# EAGLE schematic Hank2 (EAGLE 7.7.0)
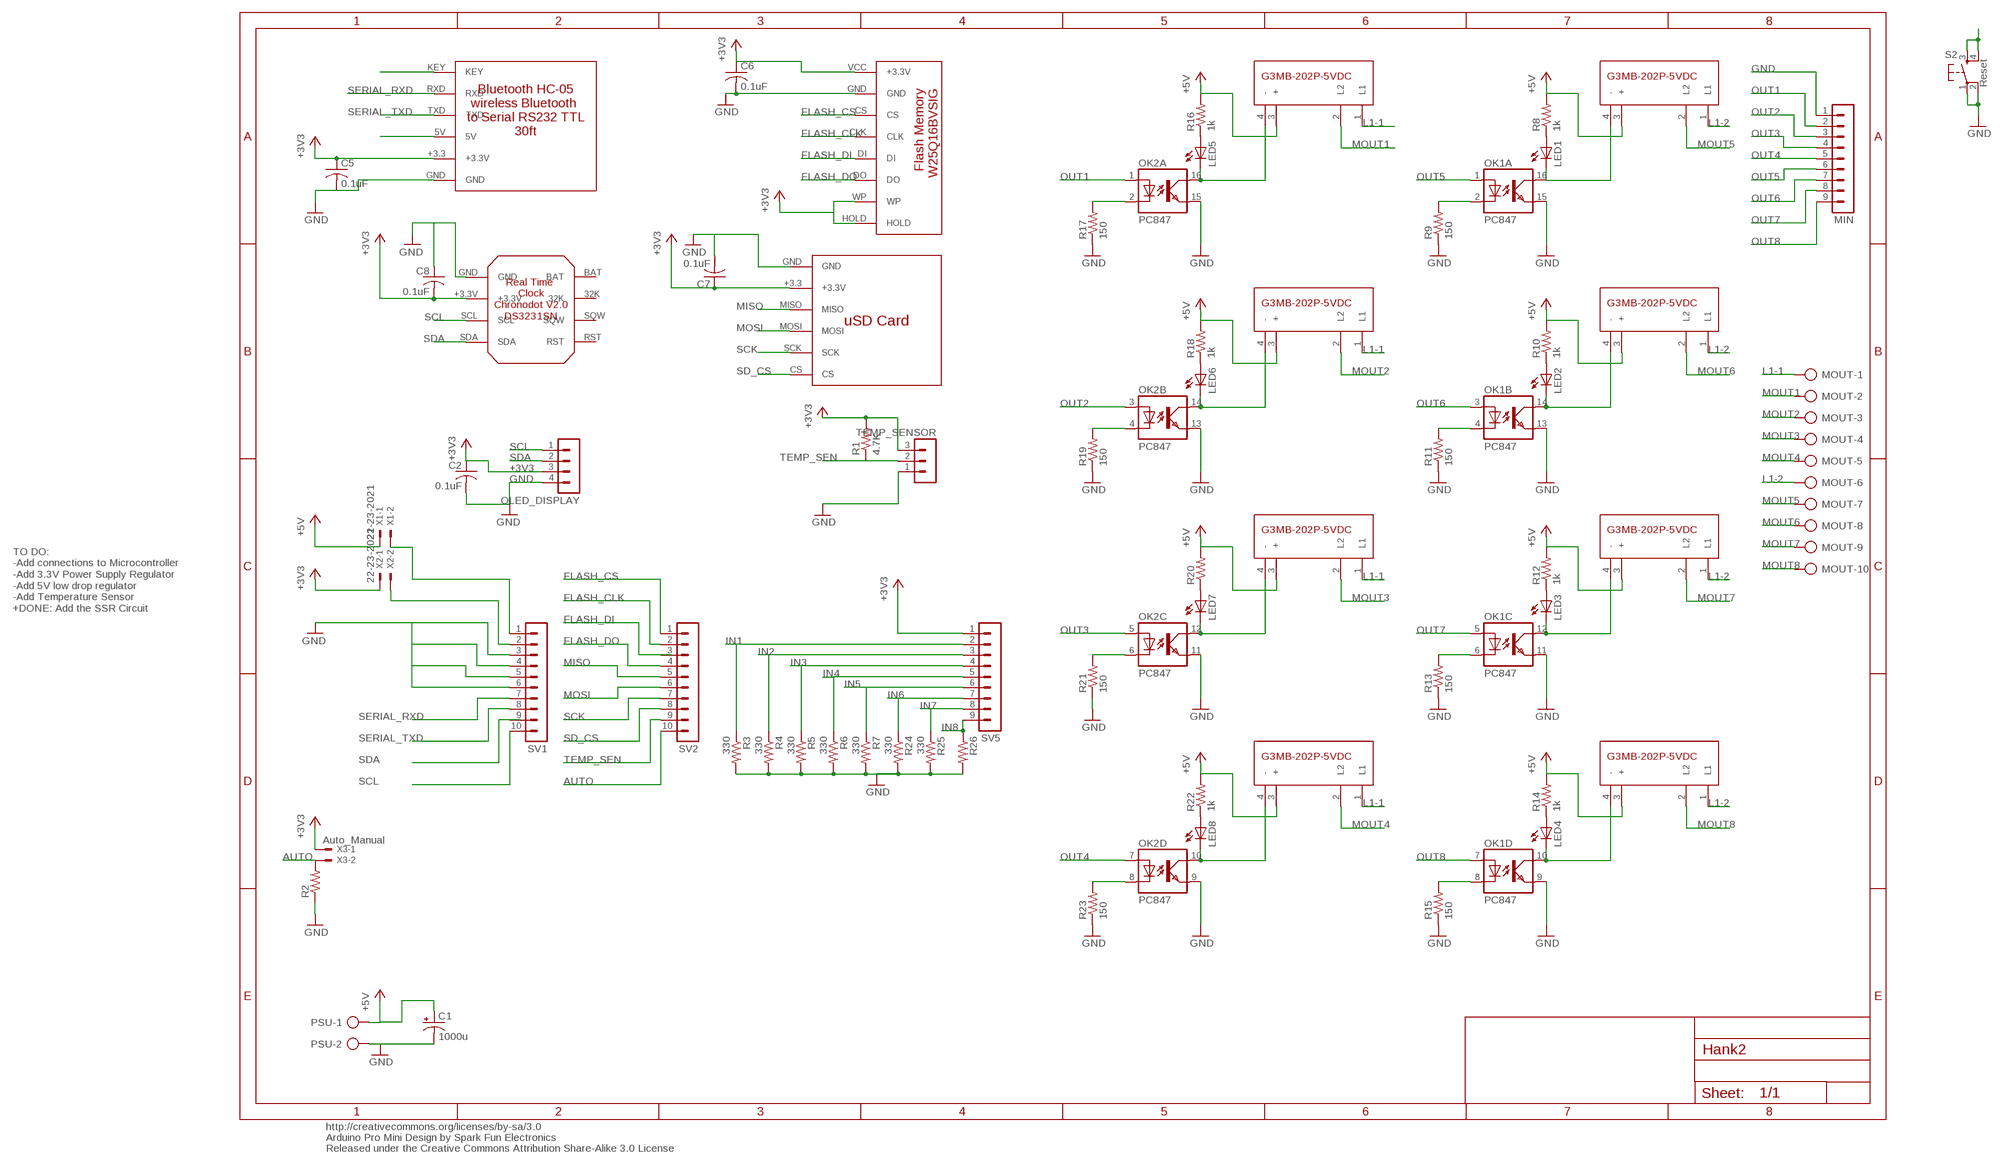
[diagram p0: schematic, sheet 1]

## Parts
C1  1000u  CPOL-USE5-8.5  [E5-8,5]
C2  0.1uF  C-US025-024X044  [C025-024X044]
C5  0.1uF  C-US025-024X044  [C025-024X044]
C6  0.1uF  C-US025-024X044  [C025-024X044]
C7  0.1uF  C-US025-024X044  [C025-024X044]
C8  0.1uF  C-US025-024X044  [C025-024X044]
LED1  LED3MM  [LED3MM]
LED2  LED3MM  [LED3MM]
LED3  LED3MM  [LED3MM]
LED4  LED3MM  [LED3MM]
LED5  LED3MM  [LED3MM]
LED6  LED3MM  [LED3MM]
LED7  LED3MM  [LED3MM]
LED8  LED3MM  [LED3MM]
MIN  MA09-1  [MA09-1]
MOUT  AK300/10  [AK300/10]
OK1  PC847  [DIL16]
OK2  PC847  [DIL16]
OLED_DISPLAY  MA04-1  [MA04-1]
PSU  AK300/2  [AK300/2]
R1  4.7K  R-US_0204/7  [0204/7]
R2  R-US_0204/7  [0204/7]
R3  330  R-US_0204/7  [0204/7]
R4  330  R-US_0204/7  [0204/7]
R5  330  R-US_0204/7  [0204/7]
R6  330  R-US_0204/7  [0204/7]
R7  330  R-US_0204/7  [0204/7]
R8  1k  R-US_0204/7  [0204/7]
R9  150  R-US_0204/7  [0204/7]
R10  1k  R-US_0204/7  [0204/7]
R11  150  R-US_0204/7  [0204/7]
R12  1k  R-US_0204/7  [0204/7]
R13  150  R-US_0204/7  [0204/7]
R14  1k  R-US_0204/7  [0204/7]
R15  150  R-US_0204/7  [0204/7]
R16  1k  R-US_0204/7  [0204/7]
R17  150  R-US_0204/7  [0204/7]
R18  1k  R-US_0204/7  [0204/7]
R19  150  R-US_0204/7  [0204/7]
R20  R-US_0204/7  [0204/7]
R21  150  R-US_0204/7  [0204/7]
R22  1k  R-US_0204/7  [0204/7]
R23  150  R-US_0204/7  [0204/7]
R24  330  R-US_0204/7  [0204/7]
R25  330  R-US_0204/7  [0204/7]
R26  R-US_0204/7  [0204/7]
S2  Reset  TAC_SWITCHSMD  [TACTILE_SWITCH_SMD]
SV1  MA10-1  [MA10-1]
SV2  MA10-1  [MA10-1]
SV5  MA09-1  [MA09-1]
TEMP_SENSOR  MA03-1  [MA03-1]
U$1  FLASH_MEMORY  [FLASHMEMORY_FOOTPRINT]
U$4  BLUETOOTH  [BLUETOOTH_FOOTPRINT]
U$6  RTC  [RTC_FOOTPRINT]
U$7  SD_CARD_READER  [SD_CARD_READER_FOOTPRINT]
U$8  SSR  [SSR_FOOTPRINT]
U$16  SSR  [SSR_FOOTPRINT]
U$17  SSR  [SSR_FOOTPRINT]
U$18  SSR  [SSR_FOOTPRINT]
U$19  SSR  [SSR_FOOTPRINT]
U$20  SSR  [SSR_FOOTPRINT]
U$21  SSR  [SSR_FOOTPRINT]
U$22  SSR  [SSR_FOOTPRINT]
X1  22-23-2021  [22-23-2021]
X2  22-23-2021  [22-23-2021]
X3  Auto_Manual  22-23-2021  [22-23-2021]

## Nets
+3V3: C2.1 C5.1 C6.1 C7.1 C8.2 OLED_DISPLAY.3 R1.2 TEMP_SENSOR.3 U$1.HOLD U$1.VCC(+3.3V) U$1.WP U$4.+3.3(+3.3V) U$6.+3.3V U$7.+3.3(+3.3V) X2.1 X3.1
+5V: C1.+ PSU.1 R8.2 R10.2 R12.2 R14.2 R16.2 R18.2 R20.2 R22.2 U$8.3(+) U$16.3(+) U$17.3(+) U$18.3(+) U$19.3(+) U$20.3(+) U$21.3(+) U$22.3(+) X1.1
AUTO: R2.2 SV2.10 X3.2
FLASH_CLK: SV2.2 U$1.CLK
FLASH_CS: SV2.1 U$1.CS
FLASH_DI: SV2.3 U$1.DI
FLASH_DO: SV2.4 U$1.DO
GND [vcc]: C1.- C2.2 C5.2 C6.2 C7.2 C8.1 MIN.1 OK1.9(D:EMIT) OK1.11(C:EMIT) OK1.13(B:EMIT) OK1.15(A:EMIT) OK2.9(D:EMIT) OK2.11(C:EMIT) OK2.13(B:EMIT) OK2.15(A:EMIT) OLED_DISPLAY.4 PSU.2 R2.1 R9.1 R11.1 R13.1 R15.1 R17.1 R19.1 R21.1 R23.1 S2.1 S2.2 SV1.3 SV1.4 SV1.5 SV1.6 TEMP_SENSOR.1 U$1.GND U$4.GND U$6.GND U$7.GND
IN1: R3.1 SV5.2
IN2: R4.1 SV5.3
IN3: R5.1 SV5.4
IN4: R6.1 SV5.5
IN5: R7.1 SV5.6
IN6: R24.1 SV5.7
IN7: R25.1 SV5.8
IN8: R26.1 SV5.9
L1-1: MOUT.1 U$19.1(L1) U$20.1(L1) U$21.1(L1) U$22.1(L1)
L1-2: MOUT.6 U$8.1(L1) U$16.1(L1) U$17.1(L1) U$18.1(L1)
MISO: SV2.5 U$7.MISO
MOSI: SV2.6 U$7.MOSI
MOUT1: MOUT.2 U$19.2(L2)
MOUT2: MOUT.3 U$20.2(L2)
MOUT3: MOUT.4 U$21.2(L2)
MOUT4: MOUT.5 U$22.2(L2)
MOUT5: MOUT.7 U$8.2(L2)
MOUT6: MOUT.8 U$16.2(L2)
MOUT7: MOUT.9 U$17.2(L2)
MOUT8: MOUT.10 U$18.2(L2)
N$1: SV1.1 X1.2
N$2: SV1.2 X2.2
N$7: R3.2 R4.2 R5.2 R6.2 R7.2 R24.2 R25.2 R26.2 ; supply symbol labelled GND
N$8: SV5.1 ; supply symbol labelled +3V3
N$10: U$4.KEY
N$11: LED1.A R8.1
N$12: LED1.K(C) OK1.16(A:COL) U$8.4(-)
N$13: U$4.5V
N$14: SV1.10
N$15: OK1.2(A:C) R9.2
N$16: LED2.A R10.1
N$17: LED2.K(C) OK1.14(B:COL) U$16.4(-)
N$19: OK1.4(B:C) R11.2
N$20: LED3.A R12.1
N$21: LED3.K(C) OK1.12(C:COL) U$17.4(-)
N$24: OK1.6(C:C) R13.2
N$25: LED4.A R14.1
N$26: LED4.K(C) OK1.10(D:COL) U$18.4(-)
N$28: OK1.8(D:C) R15.2
N$29: LED5.A R16.1
N$30: LED5.K(C) OK2.16(A:COL) U$19.4(-)
N$32: OK2.2(A:C) R17.2
N$33: LED6.A R18.1
N$34: LED6.K(C) OK2.14(B:COL) U$20.4(-)
N$36: OK2.4(B:C) R19.2
N$37: LED7.A R20.1
N$38: LED7.K(C) OK2.12(C:COL) U$21.4(-)
N$40: OK2.6(C:C) R21.2
N$41: LED8.A R22.1
N$42: LED8.K(C) OK2.10(D:COL) U$22.4(-)
N$44: OK2.8(D:C) R23.2
OUT1: MIN.2 OK2.1(A:A)
OUT2: MIN.3 OK2.3(B:A)
OUT3: MIN.4 OK2.5(C:A)
OUT4: MIN.5 OK2.7(D:A)
OUT5: MIN.6 OK1.1(A:A)
OUT6: MIN.7 OK1.3(B:A)
OUT7: MIN.8 OK1.5(C:A)
OUT8: MIN.9 OK1.7(D:A)
RESET: S2.3 S2.4
SCK: SV2.7 U$7.SCK
SCL: OLED_DISPLAY.1 U$6.SCL
SD_CS: SV2.8 U$7.CS
SDA: OLED_DISPLAY.2 U$6.SDA
SERIAL_RXD: SV1.7 U$4.RXD
SERIAL_TXD: SV1.8 U$4.TXD
TEMP_SEN: R1.1 SV2.9 TEMP_SENSOR.2
Unconnected: SV1.9 U$6.32K U$6.BAT U$6.RST U$6.SQW

## Notes on the sheet
- TO DO:
  -Add connections to Microcontroller
  -Add 3.3V Power Supply Regulator
  -Add 5V low drop regulator
  -Add Temperature Sensor
  +DONE: Add the SSR Circuit
- http://creativecommons.org/licenses/by-sa/3.0
- Arduino Pro Mini Design by Spark Fun Electronics
- Released under the Creative Commons Attribution Share-Alike 3.0 License

## Library data of the parts
C1 = rcl:CPOL-US: POLARIZED CAPACITOR, American symbol
C2 C5-C8 = rcl:C-US: CAPACITOR, American symbol
LED1-LED8 = led:LED: LED OSRAM: - CHIPLED LG R971, LG N971, LY N971, LG Q971, LY Q971, LO R971, LY R971 LH N974, LH R974 LS Q976, LO Q976, LY Q976 LO Q996 - Hyper CHIPLED LW Q18S LB Q993, LB Q99A, LB R99A - SideLED LS A670, LO A670, LY A670, LG A670, LP A670 LB A673, LV A673, LT A673, LW A673 LH A674 LY A675 LS A676, LA A676, LO A676, LY A676, LW A676 LS A679, LY A679, LG A679 - Hyper Micro SIDELED® LS Y876, LA Y876, LO Y876, LY Y876 LT Y87S - SmartLED LW L88C, LW L88S LB L89C, LB L89S, LG L890 LS L89K, LO L89K, LY L89K LS L896, LA L896, LO L896, LY L896 - TOPLED LS T670, LO T670, LY T670, LG T670, LP T670 LSG T670, LSP T670, LSY T670, LOP T670, LYG T670 LG T671, LOG T671, LSG T671 LB T673, LV T673, LT T673, LW T673 LH T674 LS T676, LA T676, LO T676, LY T676, LB T676, LH T676, LSB T676, LW T676 LB T67C, LV T67C, LT T67C, LS T67K, LO T67K, LY T67K, LW E67C LS E67B, LA E67B, LO E67B, LY E67B, LB E67C, LV E67C, LT E67C LW T67C LS T679, LY T679, LG T679 LS T770, LO T770, LY T770, LG T770, LP T770 LB T773, LV T773, LT T773, LW T773 LH T774 LS E675, LA E675, LY E675, LS T675 LS T776, LA T776, LO T776, LY T776, LB T776 LHGB T686 LT T68C, LB T68C - Hyper Mini TOPLED® LB M676 - Mini TOPLED Santana® LG M470 LS M47K, LO M47K, LY M47K Source: http://www.osram.convergy.de LUXEON: - LUMILED® LXK2-PW12-R00, LXK2-PW12-S00, LXK2-PW14-U00, LXK2-PW14-V00 LXK2-PM12-R00, LXK2-PM12-S00, LXK2-PM14-U00 LXK2-PE12-Q00, LXK2-PE12-R00, LXK2-PE12-S00, LXK2-PE14-T00, LXK2-PE14-U00 LXK2-PB12-K00, LXK2-PB12-L00, LXK2-PB12-M00, LXK2-PB14-N00, LXK2-PB14-P00, LXK2-PB14-Q00 LXK2-PR12-L00, LXK2-PR12-M00, LXK2-PR14-Q00, LXK2-PR14-R00 LXK2-PD12-Q00, LXK2-PD12-R00, LXK2-PD12-S00 LXK2-PH12-R00, LXK2-PH12-S00 LXK2-PL12-P00, LXK2-PL12-Q00, LXK2-PL12-R00 Source: www.luxeon.com KINGBRIGHT: KA-3528ASYC Source: www.kingbright.com
MIN SV5 = con-lstb:MA09-1: PIN HEADER; OC_FARNELL: unknown; OC_NEWARK: unknown
MOUT = con-ptr500:AK300/10: CONNECTOR; OC_FARNELL: unknown; OC_NEWARK: unknown
OK1 OK2 = optocoupler:PC847: SHARP OPTO COUPLER; OC_FARNELL: 9707735; OC_NEWARK: unknown
OLED_DISPLAY = con-lstb:MA04-1: PIN HEADER; OC_FARNELL: unknown; OC_NEWARK: unknown
PSU = con-ptr500:AK300/2: CONNECTOR; OC_FARNELL: unknown; OC_NEWARK: unknown
R1-R26 = rcl:R-US_: RESISTOR, American symbol
S2 = SparkFun:TAC_SWITCH: Momentary Switch Button commonly used for reset or general input. Spark Fun Electronics SKU : COM-00097
SV1 SV2 = con-lstb:MA10-1: PIN HEADER; OC_FARNELL: unknown; OC_NEWARK: unknown
TEMP_SENSOR = con-lstb:MA03-1: PIN HEADER; OC_FARNELL: unknown; OC_NEWARK: unknown
U$1 = HankLibraries:FLASH_MEMORY
U$4 = HankLibraries:BLUETOOTH
U$6 = HankLibraries:RTC: Real Time Clock PCB Using DS3231SN. Developed by JVivas
U$7 = HankLibraries:SD_CARD_READER
U$8 U$16-U$22 = HankLibraries:SSR
X1-X3 = con-molex:22-23-2021: .100" (2.54mm) Center Header - 2 Pin; MF: MOLEX; MPN: 22-23-2021; OC_FARNELL: 1462926; OC_NEWARK: 25C3832

## Net classes
0 default: width 0.203 mm
1 vcc: width 0.254 mm